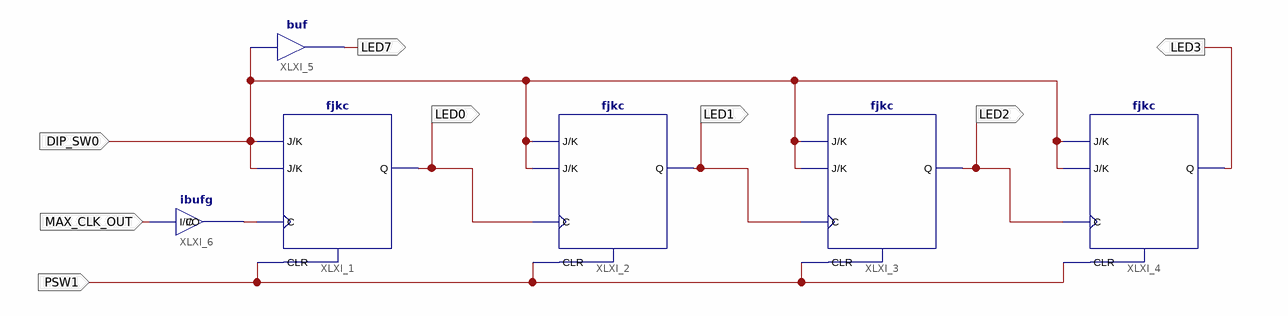
[diagram p0: schematic sheet 1]
// Xilinx ISE schematic lab7_1_acounter.sch (spartan3) as structural Verilog: 6 symbols, 8 ports
module lab7_1_acounter (
  input  PSW1,
  input  DIP_SW0,
  input  MAX_CLK_OUT,
  output LED0,
  output LED2,
  output LED3,
  output LED1,
  output LED7
);

  fjkc XLXI_1 (.C(MAX_CLK_OUT), .CLR(PSW1), .J(DIP_SW0), .K(DIP_SW0), .Q(LED0));
  fjkc XLXI_2 (.C(LED0), .CLR(PSW1), .J(DIP_SW0), .K(DIP_SW0), .Q(LED1));
  fjkc XLXI_3 (.C(LED1), .CLR(PSW1), .J(DIP_SW0), .K(DIP_SW0), .Q(LED2));
  fjkc XLXI_4 (.C(LED2), .CLR(PSW1), .J(DIP_SW0), .K(DIP_SW0), .Q(LED3));
  buf XLXI_5 (LED7, DIP_SW0);
  ibufg XLXI_6 (.I(MAX_CLK_OUT), .O(MAX_CLK_OUT));
endmodule
